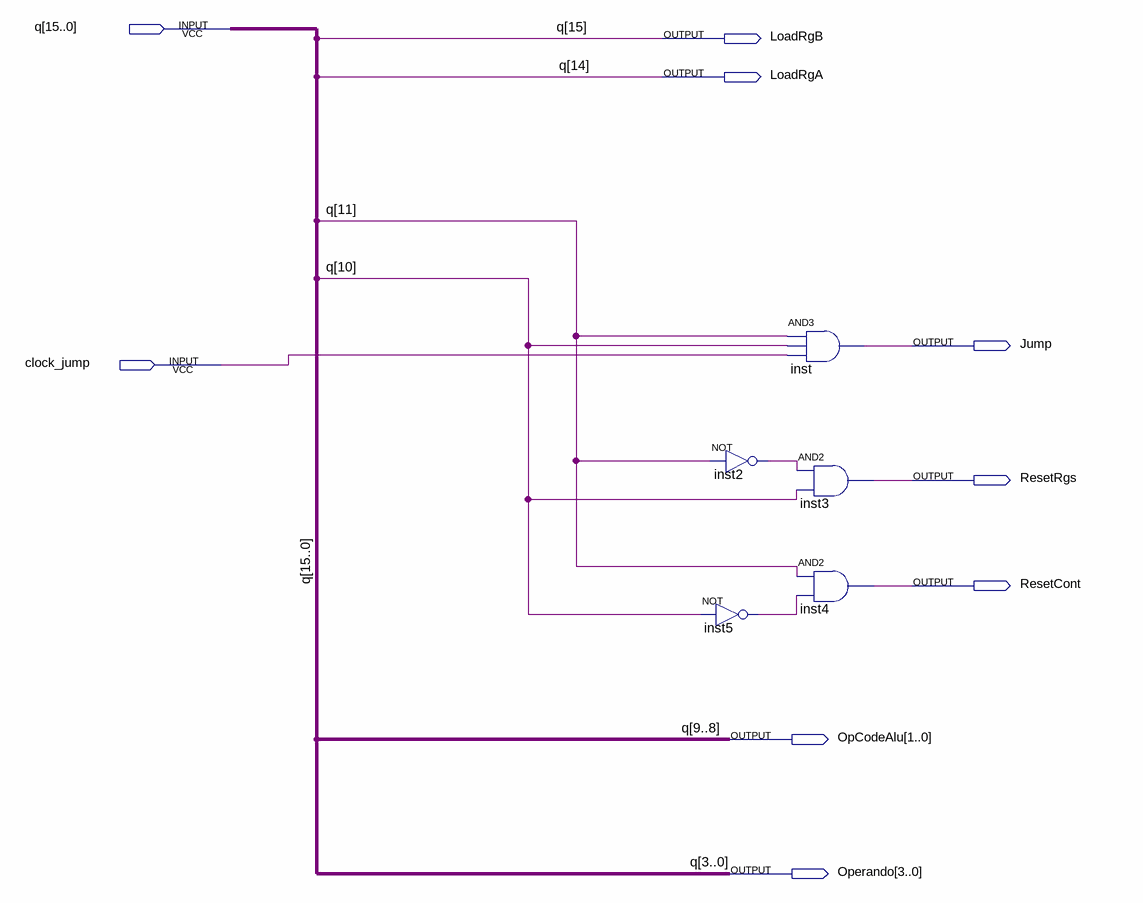
[diagram p0: schematic sheet]
// Quartus schematic UnidadeDeControle.bdf as structural Verilog: 5 symbols, 9 pins
module UnidadeDeControle (
  input  [15:0] q,
  input  clock_jump,
  output LoadRgB,
  output LoadRgA,
  output Jump,
  output ResetRgs,
  output ResetCont,
  output [1:0] OpCodeAlu,
  output [3:0] Operando
);

  wire inst2_out, inst5_out;

  not inst2 (inst2_out, q[11]);
  not inst5 (inst5_out, q[10]);
  and inst (Jump, q[11], q[10], clock_jump);
  and inst3 (ResetRgs, inst2_out, q[10]);
  and inst4 (ResetCont, q[11], inst5_out);

  assign LoadRgA = q[14];
  assign LoadRgB = q[15];
  assign OpCodeAlu = q[9:8];
  assign Operando = q[3:0];
endmodule
